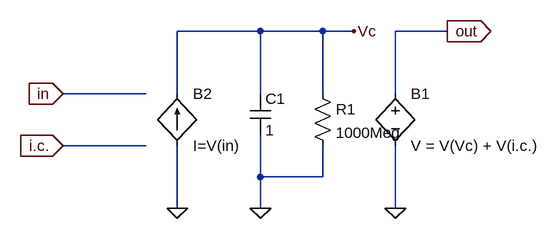
[diagram p0: schematic Integrator.asc]
Integrator.asc, the LTspice schematic file:
Version 4
SHEET 1 880 680
WIRE 224 32 96 32
WIRE 320 32 224 32
WIRE 368 32 320 32
WIRE 512 32 432 32
WIRE 48 128 -80 128
WIRE 96 128 96 32
WIRE 224 128 224 32
WIRE 320 128 320 32
WIRE 432 128 432 32
WIRE 48 208 -80 208
WIRE 224 256 224 192
WIRE 320 256 320 208
WIRE 320 256 224 256
WIRE 96 304 96 208
WIRE 224 304 224 256
WIRE 432 304 432 208
FLAG -80 128 in
IOPIN -80 128 In
FLAG 432 304 0
FLAG 512 32 out
IOPIN 512 32 Out
FLAG 96 304 0
FLAG 224 304 0
FLAG 368 32 Vc
FLAG -80 208 i.c.
IOPIN -80 208 In
SYMBOL bv 432 112 R0
SYMATTR InstName B1
SYMATTR Value V = V(Vc) + V(i.c.)
SYMBOL bi2 96 128 R0
SYMATTR InstName B2
SYMATTR Value I=V(in)
SYMBOL cap 208 128 R0
SYMATTR InstName C1
SYMATTR Value 1
SYMBOL res 304 112 R0
SYMATTR InstName R1
SYMATTR Value 1000Meg

The netlist it stands for:
* Integrator.asc
B1 out 0 V = V(Vc) + V(i.c.)
B2 0 Vc I=V(in)
C1 Vc 0 1
R1 Vc 0 1000Meg
.backanno
.end